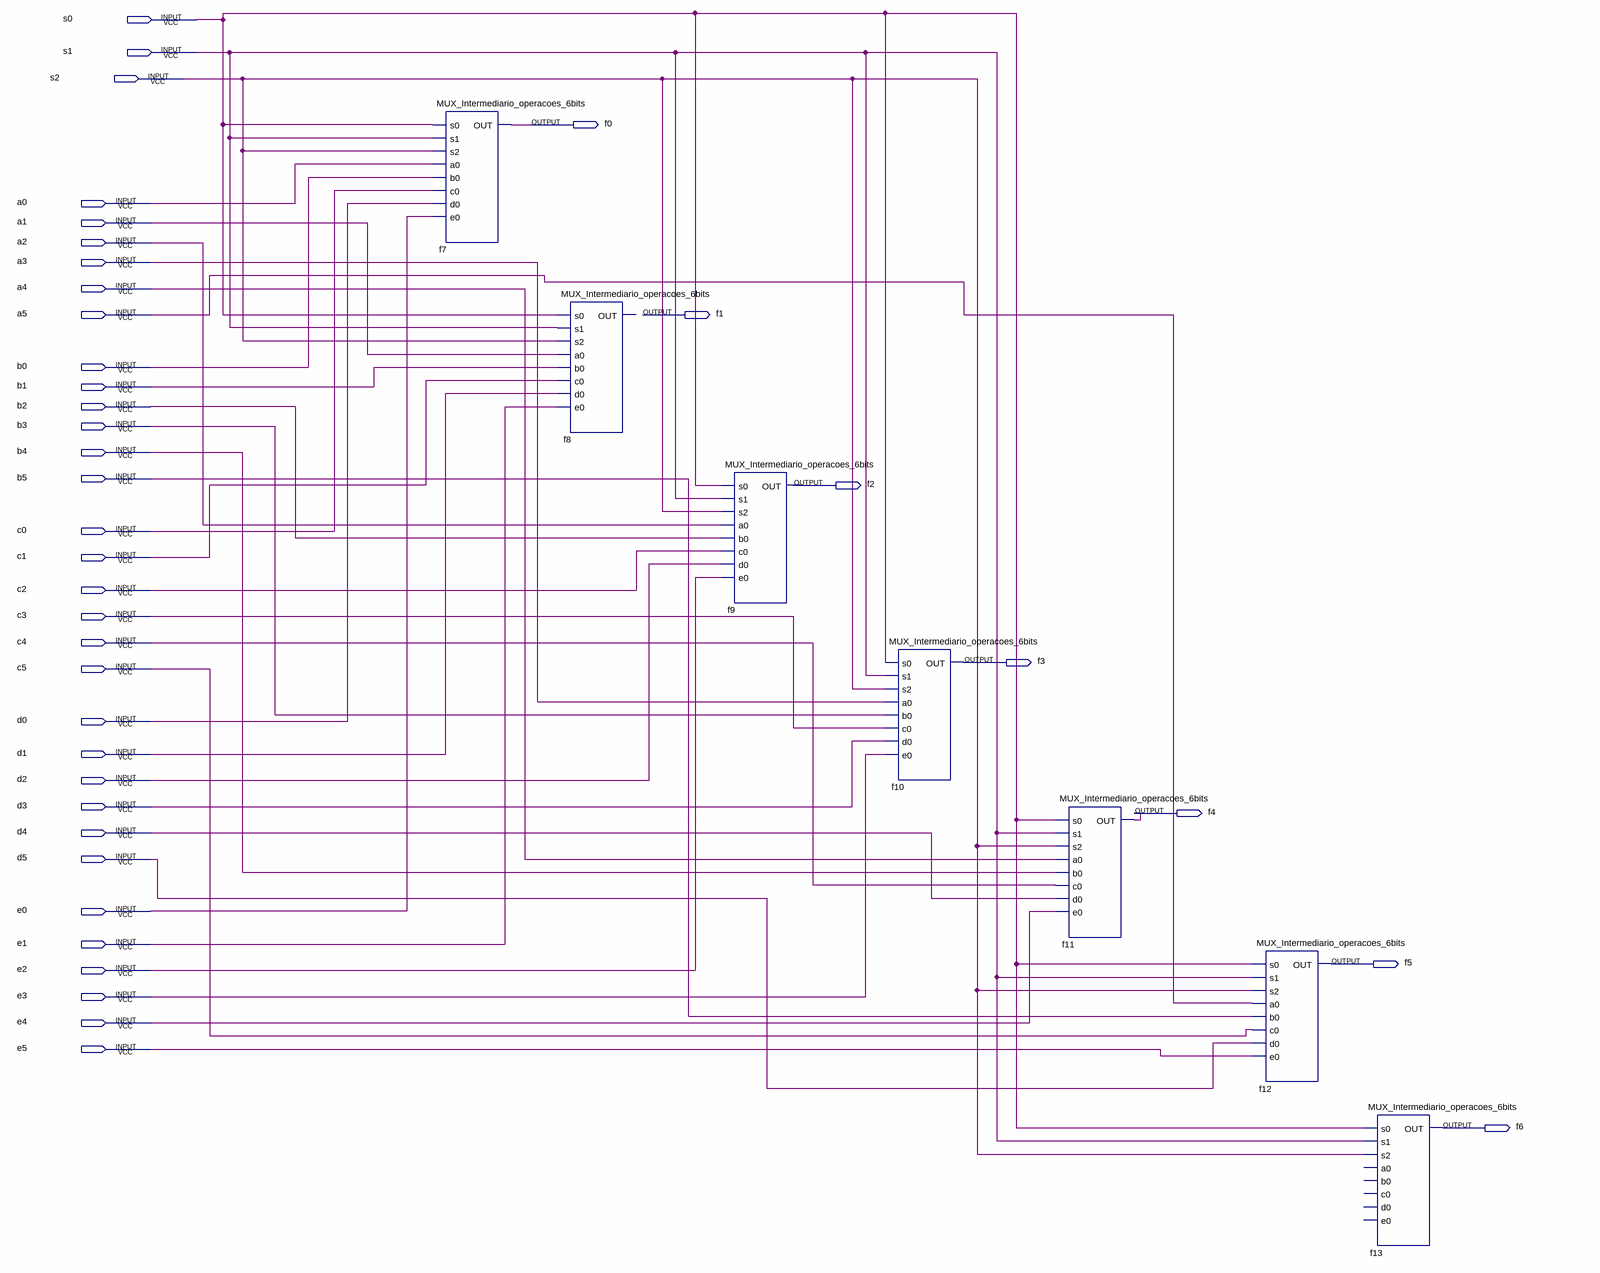
[diagram p0: schematic sheet]
// Quartus schematic MUX_Operacoes.bdf as structural Verilog: 7 symbols, 40 pins
module MUX_Operacoes (
  input  s0,
  input  s1,
  input  s2,
  input  a0,
  input  a1,
  input  a2,
  input  a3,
  input  a4,
  input  a5,
  input  b0,
  input  b1,
  input  b2,
  input  b3,
  input  b4,
  input  b5,
  input  c0,
  input  c1,
  input  c2,
  input  c3,
  input  c4,
  input  c5,
  input  d0,
  input  d1,
  input  d2,
  input  d3,
  input  d4,
  input  d5,
  input  e0,
  input  e1,
  input  e2,
  input  e3,
  input  e4,
  input  e5,
  output f0,
  output f1,
  output f2,
  output f3,
  output f4,
  output f5,
  output f6
);

  MUX_Intermediario_operacoes_6bits f7 (
    .s0(s0), .s1(s1), .s2(s2), .a0(a0), .b0(b0), .c0(c0), .d0(d0), .e0(e0), .OUT(f0));
  MUX_Intermediario_operacoes_6bits f8 (
    .s0(s0), .s1(s1), .s2(s2), .a0(a1), .b0(b1), .c0(c1), .d0(d1), .e0(e1));  // open: OUT
  MUX_Intermediario_operacoes_6bits f9 (
    .s0(s0), .s1(s1), .s2(s2), .a0(a2), .b0(b2), .c0(c2), .d0(d2), .e0(e2));  // open: OUT
  MUX_Intermediario_operacoes_6bits f10 (
    .s0(s0), .s1(s1), .s2(s2), .a0(a3), .b0(b3), .c0(c3), .d0(d3), .e0(e3), .OUT(f3));
  MUX_Intermediario_operacoes_6bits f11 (
    .s0(s0), .s1(s1), .s2(s2), .a0(a4), .b0(b4), .c0(c4), .d0(d4), .e0(e4), .OUT(f4));
  MUX_Intermediario_operacoes_6bits f12 (
    .s0(s0), .s1(s1), .s2(s2), .a0(a5), .b0(b5), .c0(c5), .d0(d5), .e0(e5), .OUT(f5));
  MUX_Intermediario_operacoes_6bits f13 (.s0(s0), .s1(s1), .s2(s2), .OUT(f6));  // open: a0, b0, c0, d0, e0
endmodule
